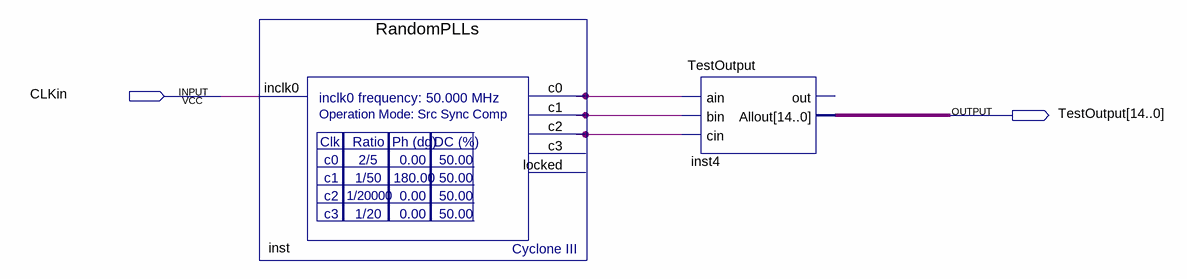
[diagram p0: schematic sheet]
// Quartus schematic RandomSeq.bdf as structural Verilog: 2 symbols, 2 pins
module RandomSeq (
  input  CLKin,
  output [14:0] TestOutput
);

  wire inst_c0, inst_c1, inst_c2;

  RandomPLLs inst (.inclk0(CLKin), .c0(inst_c0), .c1(inst_c1), .c2(inst_c2));  // open: c3, locked
  TestOutput inst4 (.ain(inst_c0), .bin(inst_c1), .cin(inst_c2), .Allout(TestOutput));  // open: out
endmodule
